# EAGLE schematic programmable-ball_main (EAGLE 9.6.2)
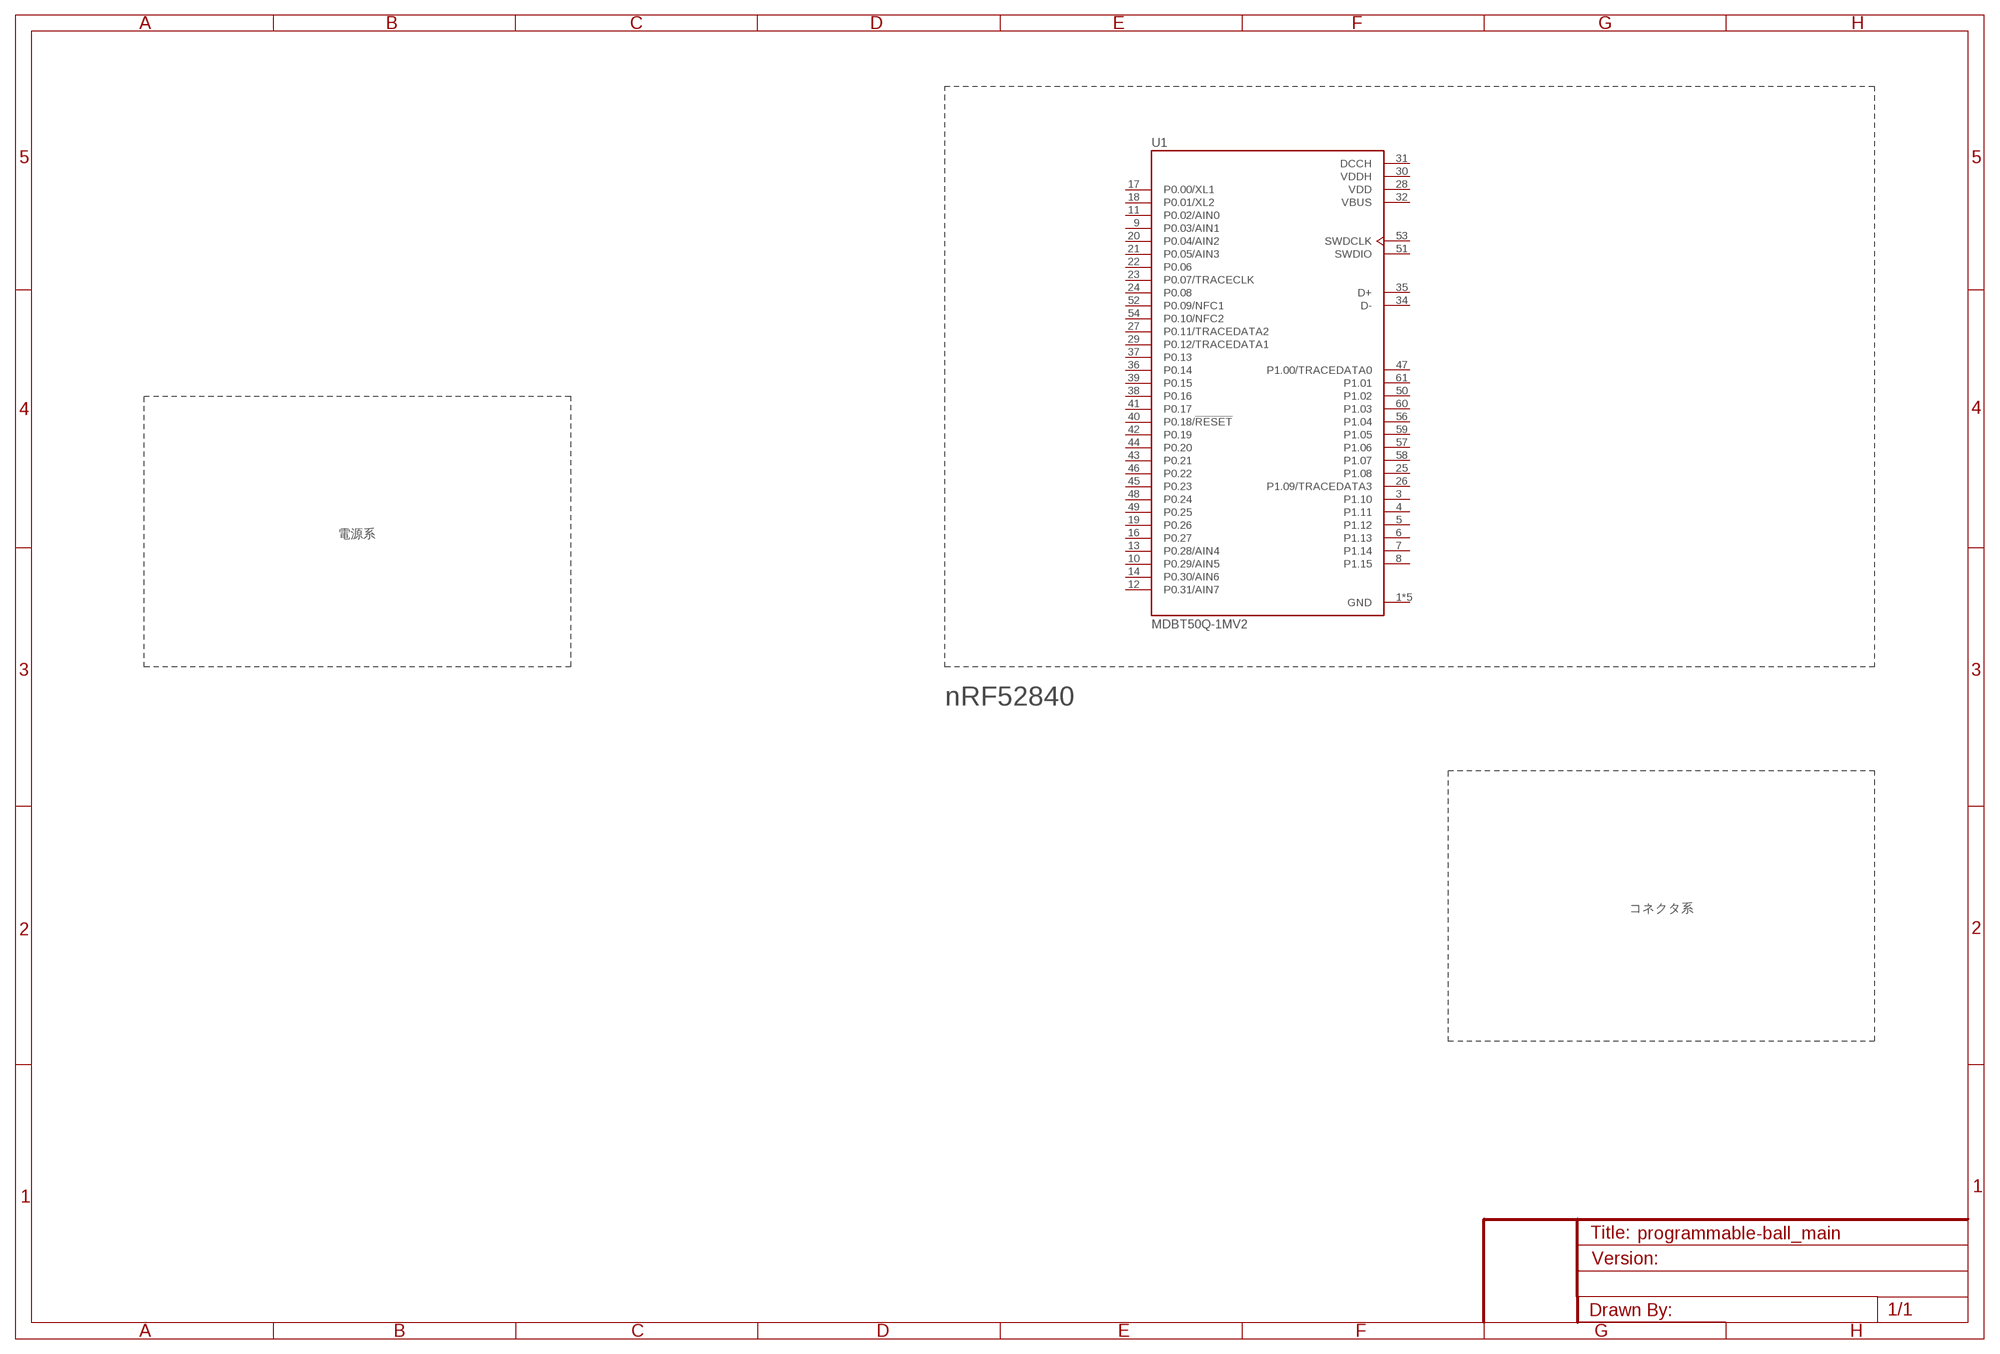
[diagram p0: schematic, sheet 1]

## Parts
U1  MDBT50Q-1MV2  [XCVR_MDBT50Q-1MV2]
Unconnected: U1.3(P1.10) U1.4(P1.11) U1.5(P1.12) U1.6(P1.13) U1.7(P1.14) U1.8(P1.15) U1.9(P0.03/AIN1) U1.10(P0.29/AIN5) U1.11(P0.02/AIN0) U1.12(P0.31/AIN7) U1.13(P0.28/AIN4) U1.14(P0.30/AIN6) U1.16(P0.27) U1.17(P0.00/XL1) U1.18(P0.01/XL2) U1.19(P0.26) U1.20(P0.04/AIN2) U1.21(P0.05/AIN3) U1.22(P0.06) U1.23(P0.07/TRACECLK) U1.24(P0.08) U1.25(P1.08) U1.26(P1.09/TRACEDATA3) U1.27(P0.11/TRACEDATA2) U1.29(P0.12/TRACEDATA1) U1.34(D-) U1.35(D+) U1.36(P0.14) U1.37(P0.13) U1.38(P0.16) U1.39(P0.15) U1.40(P0.18/!RESET) U1.41(P0.17) U1.42(P0.19) U1.43(P0.21) U1.44(P0.20) U1.45(P0.23) U1.46(P0.22) U1.47(P1.00/TRACEDATA0) U1.48(P0.24) U1.49(P0.25) U1.50(P1.02) U1.51(SWDIO) U1.52(P0.09/NFC1) U1.53(SWDCLK) U1.54(P0.10/NFC2) U1.56(P1.04) U1.57(P1.06) U1.58(P1.07) U1.59(P1.05) U1.60(P1.03) U1.61(P1.01)

## Notes on the sheet
- 電源系
- nRF52840
- コネクタ系

## Power pins joined to a net without a drawn wire
DCCH: U1.31(DCCH)
GND: U1.1(GND) U1.2(GND) U1.15(GND) U1.33(GND) U1.55(GND)
VBUS: U1.32(VBUS)
VDD: U1.28(VDD)
VDDH: U1.30(VDDH)

## Library data of the parts
U1 = MDBT50Q-1MV2:MDBT50Q-1MV2: Embedded 2.4GHz transceiver support Bluetooth V5.0 and 802.15.4 Check availability <https://pricing.snapeda.com/parts/MDBT50Q-1MV2/Raytac%20Corporation/view-part?ref=eda>; AVAILABILITY: In Stock; CHECK_PRICES: https://www.snapeda.com/parts/MDBT50Q-1MV2/Raytac+Corporation/view-part/?ref=eda; DESCRIPTION: 802.15.4, Bluetooth Bluetooth v5.2, Zigbee® Transceiver Module 2.36GHz ~ 2.5GHz Integrated, Chip Surface Mount; MF: Raytac Corporation; MP: MDBT50Q-1MV2; PACKAGE: SMD-61 Raytac Corporation; PRICE: None; SNAPEDA_LINK: https://www.snapeda.com/parts/MDBT50Q-1MV2/Raytac+Corporation/view-part/?ref=snap